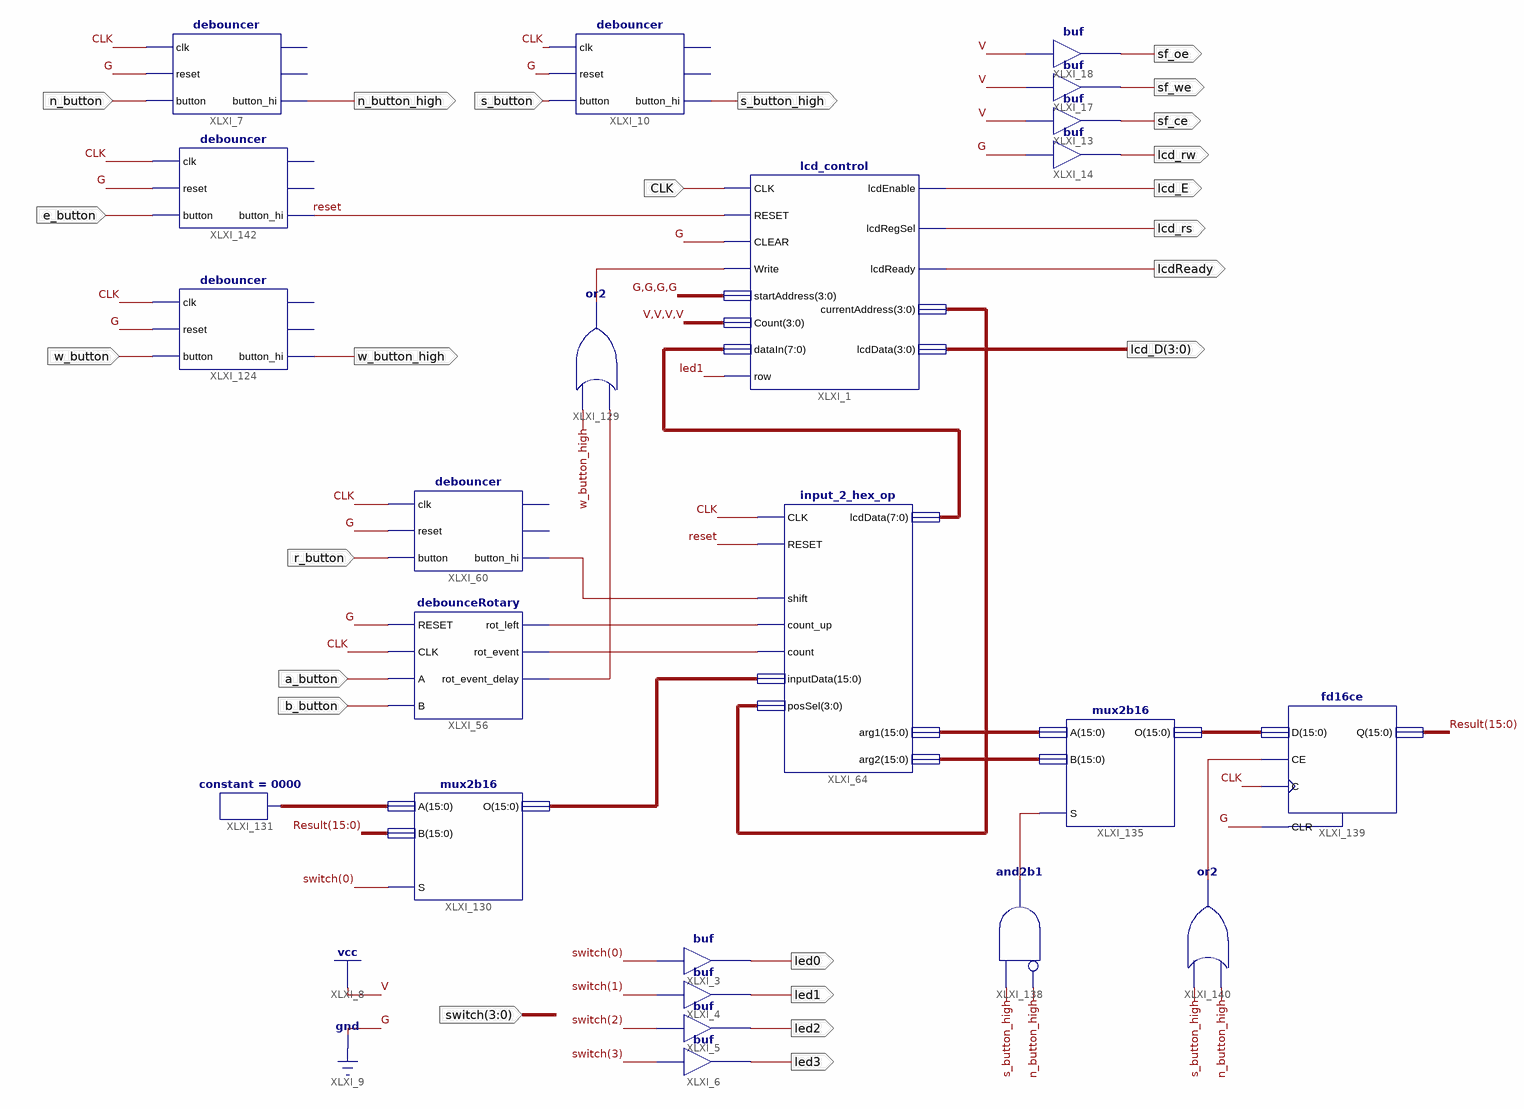
[diagram p0: schematic sheet 1]
// Xilinx ISE schematic aluIO.sch (spartan3e) as structural Verilog: 23 symbols, 24 ports
module aluIO (
  input  CLK,
  input  a_button,
  input  b_button,
  input  r_button,
  input  [3:0] switch,
  input  n_button,
  input  e_button,
  input  w_button,
  input  s_button,
  output lcdReady,
  output lcd_rs,
  output lcd_E,
  output sf_ce,
  output lcd_rw,
  output sf_we,
  output sf_oe,
  output led1,
  output led2,
  output led3,
  output n_button_high,
  output s_button_high,
  output led0,
  output w_button_high,
  output [3:0] lcd_D
);

  wire reset, XLXN_116, XLXN_135, XLXN_136, XLXN_386, XLXN_401, XLXN_408, XLXN_478;
  wire [3:0] XLXN_487;
  wire [7:0] XLXN_477;
  wire [15:0] Result, XLXN_387, XLXN_388, XLXN_402, XLXN_479, XLXN_480;

  buf XLXI_13 (sf_ce, 1'b1);
  buf XLXI_14 (lcd_rw, 1'b0);
  buf XLXI_17 (sf_we, 1'b1);
  buf XLXI_18 (sf_oe, 1'b1);
  lcd_control XLXI_1 (
    .CLK(CLK), .RESET(reset), .CLEAR(1'b0), .Write(XLXN_478), .startAddress(4'b0000), .Count(4'b1111),
    .dataIn(XLXN_477), .lcdEnable(lcd_E), .lcdRegSel(lcd_rs), .lcdReady(lcdReady), .currentAddress(XLXN_487),
    .lcdData(lcd_D), .row(led1));
  buf XLXI_3 (led0, switch[0]);
  buf XLXI_4 (led1, switch[1]);
  buf XLXI_5 (led2, switch[2]);
  buf XLXI_6 (led3, switch[3]);
  input_2_hex_op XLXI_64 (
    .CLK(CLK), .RESET(reset), .shift(XLXN_386), .count(XLXN_136), .posSel(XLXN_487), .inputData(XLXN_480),
    .count_up(XLXN_135), .lcdData(XLXN_477), .arg1(XLXN_387), .arg2(XLXN_388));
  debounceRotary XLXI_56 (
    .A(a_button), .B(b_button), .CLK(CLK), .RESET(1'b0), .rot_event(XLXN_136), .rot_event_delay(XLXN_116),
    .rot_left(XLXN_135));
  debouncer XLXI_60 (.clk(CLK), .reset(1'b0), .button(r_button), .button_hi(XLXN_386));  // open: debutton, button_lo
  mux2b16 XLXI_130 (.A(XLXN_479), .B(Result), .O(XLXN_480), .S(switch[0]));
  constant #(.CValue("0000")) XLXI_131 (.O(XLXN_479));
  mux2b16 XLXI_135 (.A(XLXN_387), .B(XLXN_388), .O(XLXN_402), .S(XLXN_401));
  and XLXI_138 (XLXN_401, ~n_button_high, s_button_high);  // and2b1
  fd16ce XLXI_139 (.C(CLK), .CE(XLXN_408), .CLR(1'b0), .D(XLXN_402), .Q(Result));
  or XLXI_140 (XLXN_408, n_button_high, s_button_high);
  debouncer XLXI_142 (.clk(CLK), .reset(1'b0), .button(e_button), .button_hi(reset));  // open: debutton, button_lo
  debouncer XLXI_7 (
    .clk(CLK), .reset(1'b0), .button(n_button), .button_hi(n_button_high));  // open: debutton, button_lo
  debouncer XLXI_124 (
    .clk(CLK), .reset(1'b0), .button(w_button), .button_hi(w_button_high));  // open: debutton, button_lo
  or XLXI_129 (XLXN_478, XLXN_116, w_button_high);
  debouncer XLXI_10 (
    .clk(CLK), .reset(1'b0), .button(s_button), .button_hi(s_button_high));  // open: debutton, button_lo
endmodule
